# Altium schematic sheet microcontroller.SchDoc
size A4; SheetNumber: 2; SheetTotal: 3
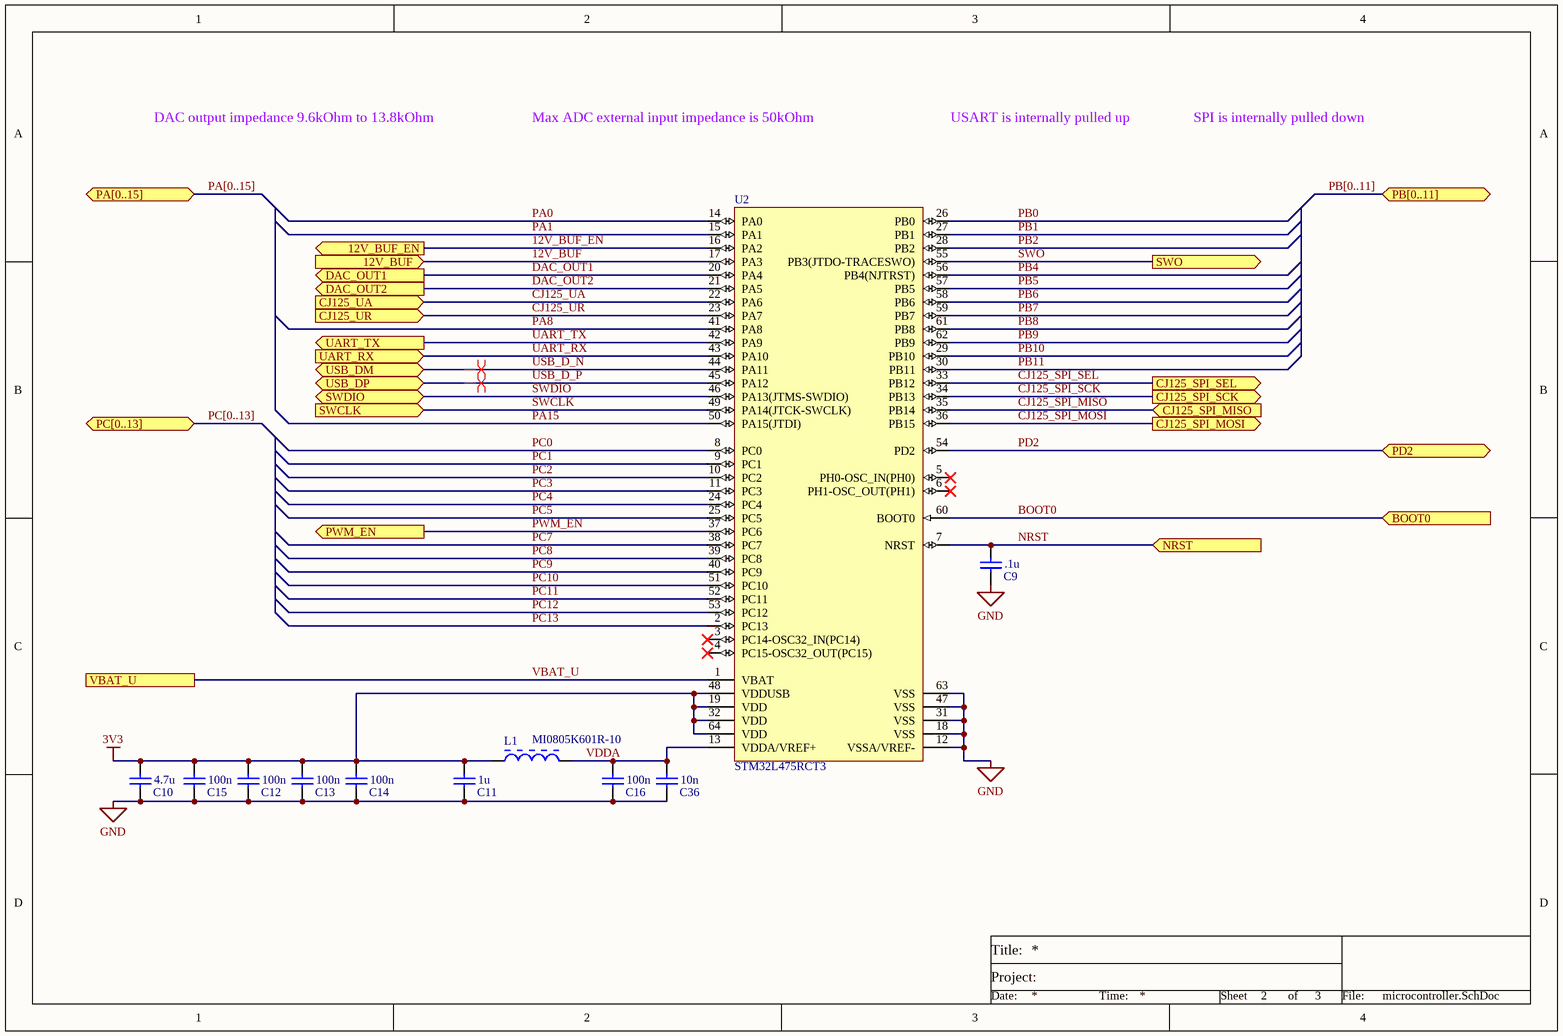
[diagram p0: microcontroller.SchDoc]

## Parts
C9  value .1u  [0805]  (hidden comment: Generic 0805 Capacitor)
C10  value 4.7u  [0805]  (hidden comment: Generic 0805 Capacitor)
C11  value 1u  [0805]  (hidden comment: Generic 0805 Capacitor)
C12  value 100n  [0805]  (hidden comment: Generic 0805 Capacitor)
C13  value 100n  [0805]  (hidden comment: Generic 0805 Capacitor)
C14  value 100n  [0805]  (hidden comment: Generic 0805 Capacitor)
C15  value 100n  [0805]  (hidden comment: Generic 0805 Capacitor)
C16  value 100n  [0805]  (hidden comment: Generic 0805 Capacitor)
C36  value 10n  [0805]  (hidden comment: Generic 0805 Capacitor)
L1  MI0805K601R-10  [LIRD-MI0805K601R-10-2_V]
U2  STM32L475RCT3  [STM-LQFP64_L]

## Ports
12V_BUF (in), 12V_BUF_EN (out), BOOT0 (in), CJ125_SPI_MISO (in), CJ125_SPI_MOSI (out), CJ125_SPI_SCK (out), CJ125_SPI_SEL (out), CJ125_UA (in), CJ125_UR (in), DAC_OUT1 (out), DAC_OUT2 (out), NRST (in), PA[0..15] (bidir), PB[0..11] (bidir), PC[0..13] (bidir), PD2 (bidir), PWM_EN (out), SWCLK (in), SWDIO (bidir), SWO (out), UART_RX (in), UART_TX (out), USB_DM (bidir), USB_DP (bidir), VBAT_U

## Nets
3V3: C10.2 C11.2 C12.2 C13.2 C14.2 C15.2 L1.1 U2.19(VDD) U2.32(VDD) U2.48(VDDUSB) U2.64(VDD)
GND: C9.1 C10.1 C11.1 C12.1 C13.1 C14.1 C15.1 C16.1 C36.1 U2.12(VSSA/VREF-) U2.18(VSS) U2.31(VSS) U2.47(VSS) U2.63(VSS)
12V_BUF: U2.17(PA3) ; port 12V_BUF
12V_BUF_EN: U2.16(PA2) ; port 12V_BUF_EN
BOOT0: U2.60(BOOT0) ; port BOOT0
CJ125_SPI_MISO: U2.35(PB14) ; port CJ125_SPI_MISO
CJ125_SPI_MOSI: U2.36(PB15) ; port CJ125_SPI_MOSI
CJ125_SPI_SCK: U2.34(PB13) ; port CJ125_SPI_SCK
CJ125_SPI_SEL: U2.33(PB12) ; port CJ125_SPI_SEL
CJ125_UA: U2.22(PA6) ; port CJ125_UA
CJ125_UR: U2.23(PA7) ; port CJ125_UR
DAC_OUT1: U2.20(PA4) ; port DAC_OUT1
DAC_OUT2: U2.21(PA5) ; port DAC_OUT2
NRST: C9.2 U2.7(NRST) ; port NRST
PA0: U2.14(PA0)
PA1: U2.15(PA1)
PA8: U2.41(PA8)
PA15: U2.50(PA15(JTDI))
PB0: U2.26(PB0)
PB1: U2.27(PB1)
PB2: U2.28(PB2)
PB4: U2.56(PB4(NJTRST))
PB5: U2.57(PB5)
PB6: U2.58(PB6)
PB7: U2.59(PB7)
PB8: U2.61(PB8)
PB9: U2.62(PB9)
PB10: U2.29(PB10)
PB11: U2.30(PB11)
PC0: U2.8(PC0)
PC1: U2.9(PC1)
PC2: U2.10(PC2)
PC3: U2.11(PC3)
PC4: U2.24(PC4)
PC5: U2.25(PC5)
PC7: U2.38(PC7)
PC8: U2.39(PC8)
PC9: U2.40(PC9)
PC10: U2.51(PC10)
PC11: U2.52(PC11)
PC12: U2.53(PC12)
PC13: U2.2(PC13)
PD2: U2.54(PD2) ; port PD2
PWM_EN: U2.37(PC6) ; port PWM_EN
SWCLK: U2.49(PA14(JTCK-SWCLK)) ; port SWCLK
SWDIO: U2.46(PA13(JTMS-SWDIO)) ; port SWDIO
SWO: U2.55(PB3(JTDO-TRACESWO)) ; port SWO
UART_RX: U2.43(PA10) ; port UART_RX
UART_TX: U2.42(PA9) ; port UART_TX
USB_D_N: U2.44(PA11) ; port USB_DM
USB_D_P: U2.45(PA12) ; port USB_DP
VBAT_U: U2.1(VBAT) ; port VBAT_U
VDDA: C16.2 C36.2 L1.2 U2.13(VDDA/VREF+)

Not connected (* = marked no-connect by the designer): U2 3(PC14-OSC32_IN(PC14))* 4(PC15-OSC32_OUT(PC15))* 5(PH0-OSC_IN(PH0))* 6(PH1-OSC_OUT(PH1))*

## Buses and harness runs
bus PA[0..15] = port PA[0..15]
bus PB[0..11] = port PB[0..11]
bus PC[0..13] = port PC[0..13]

## Layout directives
differential pair: USB_D_N, USB_D_P

## Notes on the sheet
- DAC output impedance 9.6kOhm to 13.8kOhm
- Max ADC external input impedance is 50kOhm
- USART is internally pulled up
- SPI is internally pulled down
- Title
- Title:
- Project:
- Size:
- Date:
- File:
- E
- Number:
- Time:
- Revision:
- Sheet
- of

## Library data of the parts
C9-C16 C36 = C_0805: Specifications: *
L1 = MI0805K: Chip Bead for Power Filtering, 1500 mA, 600 Ohm, -40 to 125 degC, 0805 (2012 Metric), RoHS, Tape and Reel; Manufacturer: Laird; Filter Type: PowerLine; Current Rating (Max): 1.5A; Catalog Drawings: (HI,HZ,LI,MI)0805Series_1.10mmMax.Height; Impedance @ Frequency: 600Ohm@100MHz; Number of Lines: 1; DC Resistance (DCR) (Max): 100mOhm; Other Names: 240-2390-1; Kits: 240-2227-ND-KITEMIFERRITEBEADCHIPSMD; Online Catalog: MISeries; Standard Package: 1; Datasheet Version: Rev. A, 01/2004; Height (Max): 0.043"(1.10mm); Category: Filters; Operating Temperature: -40degC~125degC; Package Description: 2-Pin Surface Mount Device, Body 2 x 1.25 mm; Package / Case: 0805(2012Metric); Package Reference: MI0805K601R-10-2; Packaging: CutTape(CT); Ratings: -; Mounting Type: SurfaceMount; Datasheet URL: https://datasheet.ciiva.com/3082/mi0805k601r-10-a-vp-3082219.pdf; Size / Dimension: 0.079"Lx0.049"W(2.00mmx1.25mm); Family: FerriteBeadsandChips; Manufacturer URL: https://www.lairdtech.com; Series: MI
U2 = STM32L475RCT3: Ultra-Low-Power ARM Cortex-M4 32-bit MCU+FPU, 256 KB Flash, 128 KB Internal RAM, 51 I/Os, 64-Pin LQFP, -40 to 125 degC, Tray; Operating Frequency(F) (Processor speed) (MHz): 80; Internal RAM Size (kB): 128; I/Os (High Current): 51; D/A Converter: 2; Supply Voltage(Vcc) min (V): 1.71; FLASH Size (Prog) (kB): 256; Package: LQFP64; Packing: Tray; DatasheetVersion: Rev. 4; Mounting Technology: Surface Mount; Core: ARM Cortex-M4; Package Description: 64-Pin Low-profile Quad Flat Package, Body 10 x 10 mm, Pitch 0.5 mm; ComponentLink1Description: Datasheet; ComponentLink1URL: http://www.st.com/content/ccc/resource/technical/document/datasheet/90/51/73/d2/53/60/4f/5f/DM00172872.pdf/files/DM00172872.pdf/jcr:content/translations/en.DM00172872.pdf; Supplier 1: Digi-Key; Supplier Part Number 1: 497-16840-ND